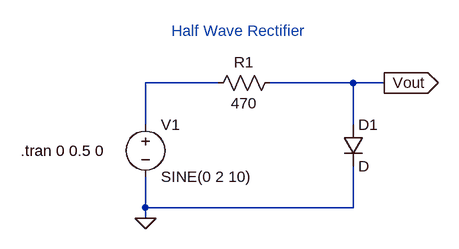
[diagram p0: schematic Half Wave Rectifier.asc]
Half Wave Rectifier.asc, the LTspice schematic file:
Version 4
SHEET 1 880 680
WIRE 160 64 48 64
WIRE 368 64 240 64
WIRE 416 64 368 64
WIRE 48 128 48 64
WIRE 368 128 368 64
WIRE 48 256 48 208
WIRE 368 256 368 192
WIRE 368 256 48 256
WIRE 48 272 48 256
FLAG 48 272 0
FLAG 416 64 Vout
IOPIN 416 64 Out
SYMBOL voltage 48 112 R0
WINDOW 123 0 0 Left 0
WINDOW 39 0 0 Left 0
SYMATTR InstName V1
SYMATTR Value SINE(0 2 10)
SYMBOL res 256 48 R90
WINDOW 0 0 56 VBottom 2
WINDOW 3 32 56 VTop 2
SYMATTR InstName R1
SYMATTR Value 470
SYMBOL diode 352 128 R0
SYMATTR InstName D1
TEXT 88 -16 Left 2 ;Half Wave Rectifier
TEXT -144 168 Left 2 !.tran 0 0.5 0

The netlist it stands for:
* Half Wave Rectifier.asc
V1 N001 0 SINE(0 2 10)
R1 Vout N001 470
D1 Vout 0 D
.model D D
.lib standard.dio
* Half Wave Rectifier
.tran 0 0.5 0
.backanno
.end